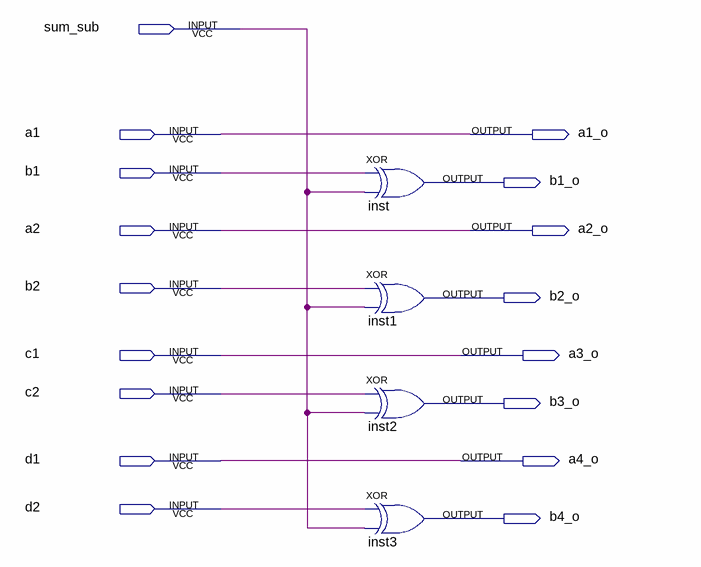
[diagram p0: schematic sheet]
// Quartus schematic sum_sub_select.bdf as structural Verilog: 4 symbols, 17 pins
module sum_sub_select (
  input  sum_sub,
  input  a1,
  input  b1,
  input  a2,
  input  b2,
  input  c1,
  input  c2,
  input  d1,
  input  d2,
  output a1_o,
  output b1_o,
  output a2_o,
  output b2_o,
  output a3_o,
  output b3_o,
  output a4_o,
  output b4_o
);

  xor inst (b1_o, b1, sum_sub);
  xor inst1 (b2_o, b2, sum_sub);
  xor inst2 (b3_o, c2, sum_sub);
  xor inst3 (b4_o, d2, sum_sub);

  assign a1_o = a1;
  assign a2_o = a2;
  assign a3_o = c1;
  assign a4_o = d1;
endmodule
